# Altium schematic sheet Sensors.SchDoc
size A3; SheetNumber: 5; SheetTotal: 6
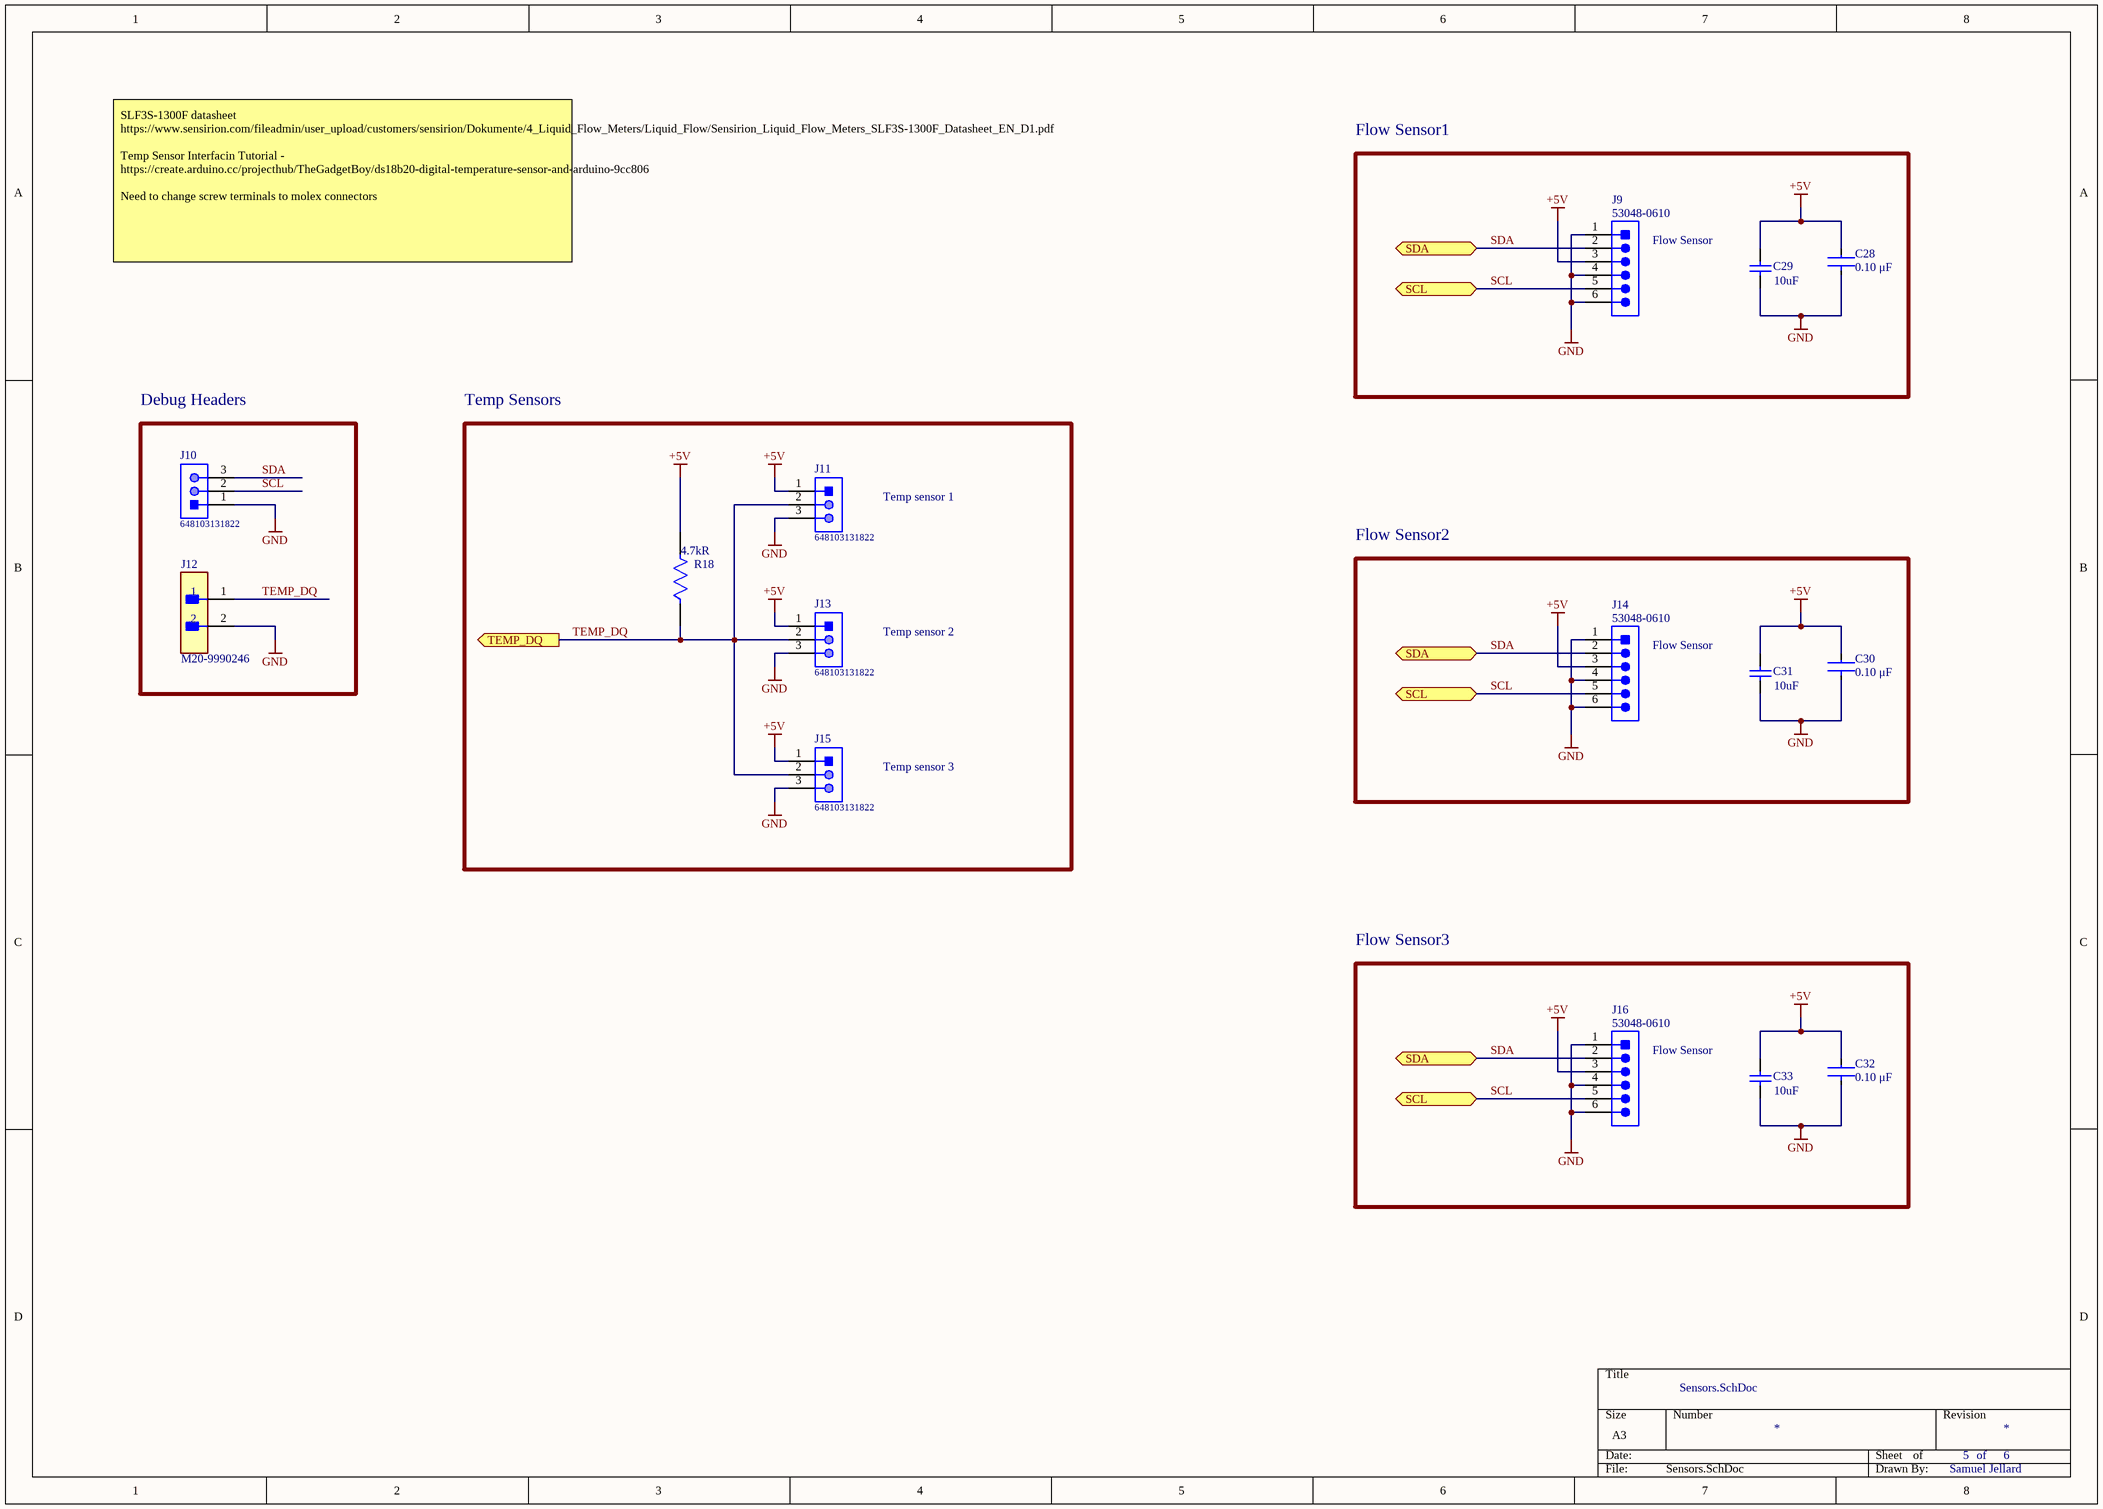
[diagram p0: Sensors.SchDoc]

## Parts
C28  value 0.10 μF  [FP-C0603C-CF-MFG]  (hidden comment: C0603C104K5RACTU)
C29  value 10uF  [CAPC0603(1608)100_N]  (hidden comment: C0603C106M9PACTU)
C30  value 0.10 μF  [FP-C0603C-CF-MFG]  (hidden comment: C0603C104K5RACTU)
C31  value 10uF  [CAPC0603(1608)100_N]  (hidden comment: C0603C106M9PACTU)
C32  value 0.10 μF  [FP-C0603C-CF-MFG]  (hidden comment: C0603C104K5RACTU)
C33  value 10uF  [CAPC0603(1608)100_N]  (hidden comment: C0603C106M9PACTU)
J9  53048-0610  [MOLX-53048-0610_V]
J10  648103131822  [648103131822]
J11  648103131822  [648103131822]
J12  M20-9990246  [FP-M20-9990246-MFG]
J13  648103131822  [648103131822]
J14  53048-0610  [MOLX-53048-0610_V]
J15  648103131822  [648103131822]
J16  53048-0610  [MOLX-53048-0610_V]
R18  Resistance: 4.7kR  [FP-CRCW0603-e3-IPC_A]  (hidden comment: CRCW06034K70FKEA)

## Blocks framed on the sheet
Flow Sensor1: C28 C29 J9
Debug Headers: J10 J12
Temp Sensors: J11 J13 J15 R18
Flow Sensor2: C30 C31 J14
Flow Sensor3: C32 C33 J16

## Ports
SCL (bidir), SDA (bidir), TEMP_DQ (out)

## Nets
+5V: C28.2 C29.2 C30.2 C31.2 C32.2 C33.2 J9.3 J11.1 J13.1 J14.3 J15.1 J16.3 R18.2
GND: C28.1 C29.1 C30.1 C31.1 C32.1 C33.1 J9.1 J9.4 J9.6 J10.1 J11.3 J12.2 J13.3 J14.1 J14.4 J14.6 J15.3 J16.1 J16.4 J16.6
SCL: J9.5 J10.2 J14.5 J16.5 ; port SCL
SDA: J9.2 J10.3 J14.2 J16.2 ; port SDA
TEMP_DQ: J11.2 J12.1 J13.2 J15.2 R18.1 ; port TEMP_DQ

## Notes on the sheet
- Flow Sensor
- SLF3S-1300F datasheet https://www.sensirion.com/fileadmin/user_upload/customers/sensirion/Dokumente/4_Liquid_Flow_Meters/Liquid_Flow/Sensirion_Liquid_Flow_Meters_SLF3S-1300F_Datasheet_EN_D1.pdf
  Temp Sensor Interfacin Tutorial - https://create.arduino.cc/projecthub/TheGadgetBoy/ds18b20-digital-temperature-sensor-and-arduino-9cc806
  Need to change screw terminals to molex connectors
- Temp sensor 1
- Temp sensor 2
- Temp sensor 3
- of
- Samuel Jellard

## Library data of the parts
C28 C30 C32 = CMP-2006-03061-2: Multilayer Ceramic Capacitors (MLCC) - SMD/SMT 50volts 0.1uF X7R 10%; Manufacturer: KEMET; Tolerance: 0.1; Temperature Coefficient: 30ppm/°C; Automotive Grade: Grade 1; Voltage Rating: 50 V; Temperature: -55°C to +125°C; RoHS: TRUE; Material: Ceramic; Temperature Range High: +125°C; Lead Free: Yes; Octopart: https://octopart.com/c0603c104k5ractu-kemet-139244; Digikey Description: CAP CER 0.1UF 50V X7R 0603; Category: Cap; Package: C0603C-CF; ComponentLink2Description: Datasheet; Temperature Range Low: -55°C; Device Class L1: Passive Components; Automotive: Yes; Device Class L3: Ceramic Capacitors; ComponentLink2URL: https://api.kemet.com/component-edge/download/datasheet/C0603C100J5GACAUTO.pdf; Capacitance: 0.10 μF; Device Class L2: Capacitors; Manufacturer Part Number: C0603C104K5RACTU; Temperature Characteristic: X7R; Height: 0.87mm
C29 C31 C33 = CMP-1035-02797-1: CAP 10uF 6.3V ±20% 0603 (1608 Metric) Thickness 1mm SMD; Case-Metric: 1608; Case-EIA: 0603; Tolerance: Â±20%; Technology: SMT; Max Thickness: 1 mm; Rated Voltage: 6.3 V
J9 J14 J16 = CMP-2000-05632-1: Male Header, Pitch 1.25 mm, 1 x 6 Position, Height 3.5 mm, Tail Length 2.3 mm, -40 to 85 degC, RoHS, Tray; Manufacturer: Molex; Number of Positions / Contacts: 6; Pitch: 1.25mm; Mounting Angle: Right; Current Rating: 1A; Voltage Rating: 125V; RoHS: Details; Termination Style: ThroughHole; Type: Shrouded; Contact Plating: Tin; Number of Rows: 1; Product Type: Headers; Product Category: 1.25mmConnectors; Datasheet Version: 01/2002; Mounting Style: ThroughHole; Package Reference: 53048-0610; Brand: Molex; Package URL: http://www.molex.com/pdm_docs/sd/530480610_sd.pdf; Factory Pack Quantity: 2000; Number of Positions: 6; Housing Material: Nylon; Contact Material: PhosphorBronze; Datasheet URL: http://www.farnell.com/datasheets/307528.pdf; Mounting Technology: ThroughHole; Manufacturer URL: http://www.molex.com/; Tradename: PicoBlade; Packaging: Tray; Series: 53048; Package Description: Male Header, Pitch 1.25 mm, 1 x 6 Position, Height 3.5 mm, Tail Length 2.3 mm
J10 J11 J13 J15 = CMP-1502-00731-1: Male Shrouded Header WR-WTB, SMT, Right Angled, pitch 1.5 mm, 1 x 3 position; Manufacturer: Wurth Elektronik; Pitch: 1.5mm; Contact Resistance: 20mOhm; Position: 1x3; Working Voltage: 50VAC; Operating Temperature: -25to85degC; Orientation: RightAngled; Publisher: WurthElektronik; Mounting Technology: SMT; Manufacturer URL: http://www.we-online.de; Gender: Male; Datasheet URL: https://katalog.we-online.de/em/datasheet/6481xx131822.pdf; Package Reference: 648103131822; Part Number: 648103131822; Packaging: TapeandReel
J12 = CMP-15831-000009-1: 2.54mm (0.1") Pitch SIL Vertical PC Tail Pin Header, 6.1mm mating pin height, tin, 2 contacts; Manufacturer: Harwin; Conn Gender: Male; Number Of Contacts: 2; Current Rating: 3A; ComponentLink2URL: https://cdn.harwin.com/pdfs/M20-999.pdf; ComponentLink2Description: Datasheet; Package: M20-9990246; Temperature: -40°C to +105°C; Octopart: https://octopart.com/m20-9990246-harwin-2590635; Mouser Description: 2.54mm (0.1") Pitch SIL Vertical PC Tail Pin Header, 6.1mm mating pin height, tin, 2 contacts; Temperature Range High: +105°C; Device Class L1: Connectors; Conn Orientation: Vertical; RoHS: TRUE; Automotive: No; Height: 8.99mm; Number Of Rows: 1; Contact Material: Tin,Nickel; Category: Conn; Pitch: 2.54mm; Lead Free: Yes; Digikey Description: CONN HEADER VERT 2POS 2.54MM; Manufacturer Part Number: M20-9990246; Temperature Range Low: -40°C; Device Class L3: unset; Device Class L2: Headers and Wire Housings
R18 = CMP-1666-00019-3: RES Thick Film, 4.7kΩ, 1%, 0.1W, 100ppm/°C, 0603; Voltage Rating: 75V; Power Rating: 100mW; Case Code (Metric): 1608; Military Standard: Not; Packaging: Tape and Reel; Termination: SMD/SMT; Temperature Coefficient: 100ppm/°C; Lead Free: Lead Free; Length: 1.55mm; Width: 0.85mm; Height: 0.45mm; Depth: 0.85mm; Weight: 7.1E-05oz; Case Code (Imperial): 0603; Contact Plating: Tin; Case/Package: 0603; Max Operating Temperature: 155°C; Mount: Surface Mount; Tolerance: 1%; Min Operating Temperature: -55°C; Package Quantity: 5000; Voltage Rating (DC): 75V; Composition: Thick Film